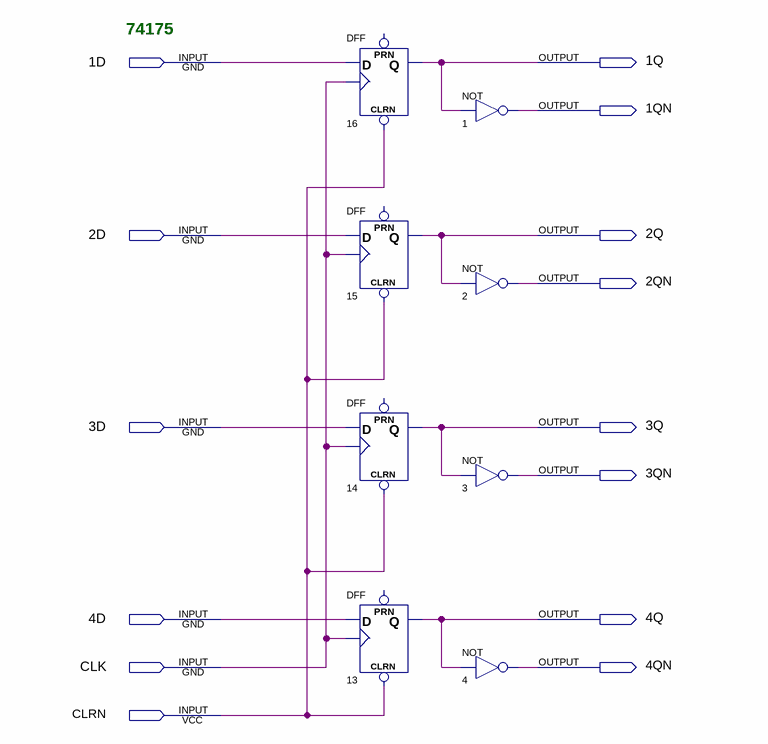
[diagram p0: schematic sheet]
// Quartus schematic 74175.bdf as structural Verilog: 8 symbols, 14 pins
module \74175  (
  input  \1D ,
  input  \2D ,
  input  \3D ,
  input  \4D ,
  input  CLK,
  input  CLRN,
  output \1Q ,
  output \1QN ,
  output \2Q ,
  output \2QN ,
  output \3Q ,
  output \3QN ,
  output \4Q ,
  output \4QN 
);

  DFF u_16 (.CLRN(CLRN), .CLK(CLK), .D(\1D ), .Q(\1Q ));  // open: PRN
  DFF u_15 (.CLRN(CLRN), .CLK(CLK), .D(\2D ), .Q(\2Q ));  // open: PRN
  DFF u_14 (.CLRN(CLRN), .CLK(CLK), .D(\3D ), .Q(\3Q ));  // open: PRN
  DFF u_13 (.CLRN(CLRN), .CLK(CLK), .D(\4D ), .Q(\4Q ));  // open: PRN
  not u_1 (\1QN , \1Q );
  not u_2 (\2QN , \2Q );
  not u_3 (\3QN , \3Q );
  not u_4 (\4QN , \4Q );

  // Notes on the sheet:
  //   74175
endmodule
